# EAGLE schematic Hardware lichtsturing schema (EAGLE 9.2.2)
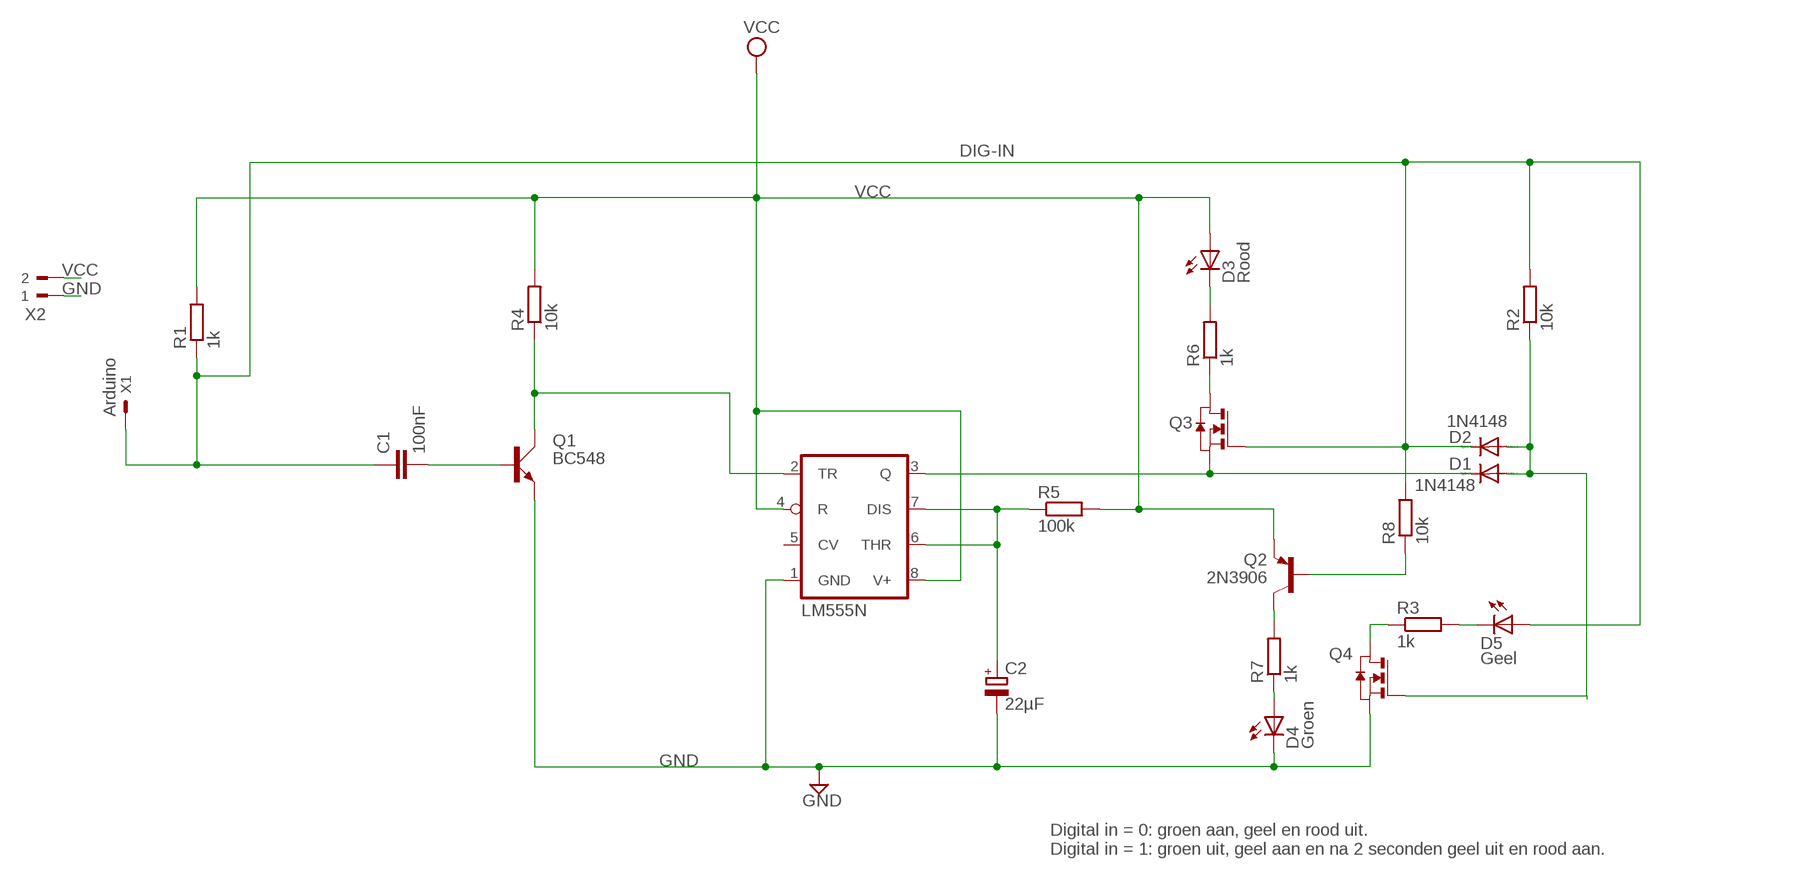
[diagram p0: schematic, sheet 1]

## Parts
C1  100nF  CAPACITOR  [C050-024X044]
C2  22µF  ELCO  [E3,5-8]
D1  1N4148  1N4148DO35-7  [DO35-7]
D2  1N4148  1N4148DO35-7  [DO35-7]
D3  Rood  TLLY4400  [LED3MM]
D4  Groen  TLLY4400  [LED3MM]
D5  Geel  TLLY4400  [LED3MM]
IC1  LM555N  [DIL08]
Q1  BC548  TIP41C  [TO220AV]
Q2  2N3906  BC307  [TO92]
Q3  NMOSE3L  [E3LINE]
Q4  NMOSE3L  [E3LINE]
R1  1k  RESISTOR  [RDH/15]
R2  10k  RESISTOR  [RDH/15]
R3  1k  RESISTOR  [RDH/15]
R4  10k  RESISTOR  [RDH/15]
R5  100k  RESISTOR  [RDH/15]
R6  1k  RESISTOR  [RDH/15]
R7  1k  RESISTOR  [RDH/15]
R8  10k  RESISTOR  [RDH/15]
X1  Arduino  332-02  [332-02]
X2  90-2  [90-2]

## Nets
DIG-IN: C1.1 D2.C D5.A Q3.2(G) R1.1 R2.2 R8.2 X1.1(S)
GND: C2.- D4.K(C) IC1.1(GND) Q1.E Q4.3(S) X2.1
N$3: C1.2 Q1.B
N$4: IC1.2(TR) Q1.C R4.1
N$5: C2.+ IC1.6(THR) IC1.7(DIS) R5.1
N$6: Q2.3(C) R7.2
N$7: D4.A R7.1
N$8: Q2.2(B) R8.1
N$9: Q3.1(D) R6.1
N$10: D3.K(C) R6.2
N$11: D1.C IC1.3(Q) Q3.3(S)
N$12: D1.A D2.A Q4.2(G) R2.1
N$14: Q4.1(D) R3.1
N$15: D5.K(C) R3.2
VCC: D3.A IC1.4(R) IC1.8(V+) Q2.1(E) R1.2 R4.2 R5.2 X2.2
Unconnected: IC1.5(CV)

## Notes on the sheet
- Digital in = 0: groen aan, geel en rood uit.
  Digital in = 1: groen uit, geel aan en na 2 seconden geel uit en rood aan.

## Library data of the parts
C1 = Hardware lichtsturing library:CAPACITOR
C2 = Hardware lichtsturing library:ELCO
D1 D2 = Hardware lichtsturing library:1N4148: DIODE high speed (Philips)
D3-D5 = Hardware lichtsturing library:TLLY4400: Low Current (2mA) LED 3 mm Tinted Diffused Package color YELLOW Source: Data sheet <http://www.farnell.com/datasheets/391098.pdf>; MF: VISHAY SEMICONDUCTOR; OC_FARNELL: 1612439
IC1 = Hardware lichtsturing library:*555: TIMER
Q1 = Hardware lichtsturing library:TIP41C: NPN TRANSISTOR
Q2 = Hardware lichtsturing library:BC307: PNP Transistor
Q3 Q4 = Hardware lichtsturing library:NMOSE3L: MOS FET; OC_FARNELL: unknown; OC_NEWARK: unknown
R1-R8 = Hardware lichtsturing library:RESISTOR
X1 = Hardware lichtsturing library:332-02: 2 Pin - 2mm Dual Row Source: www.mpe-connector.de / garry_shortform_2012.pdf
X2 = Hardware lichtsturing library:90-2: WEIDMUELLER CLAMP CONNECTOR; OC_FARNELL: unknown; OC_NEWARK: unknown